# EAGLE design Adafruit SCD-41 (EAGLE 9.6.2)
COMPANY: ADAFRUIT INDUSTRIES; DRAWN: KTOWN; REV: A
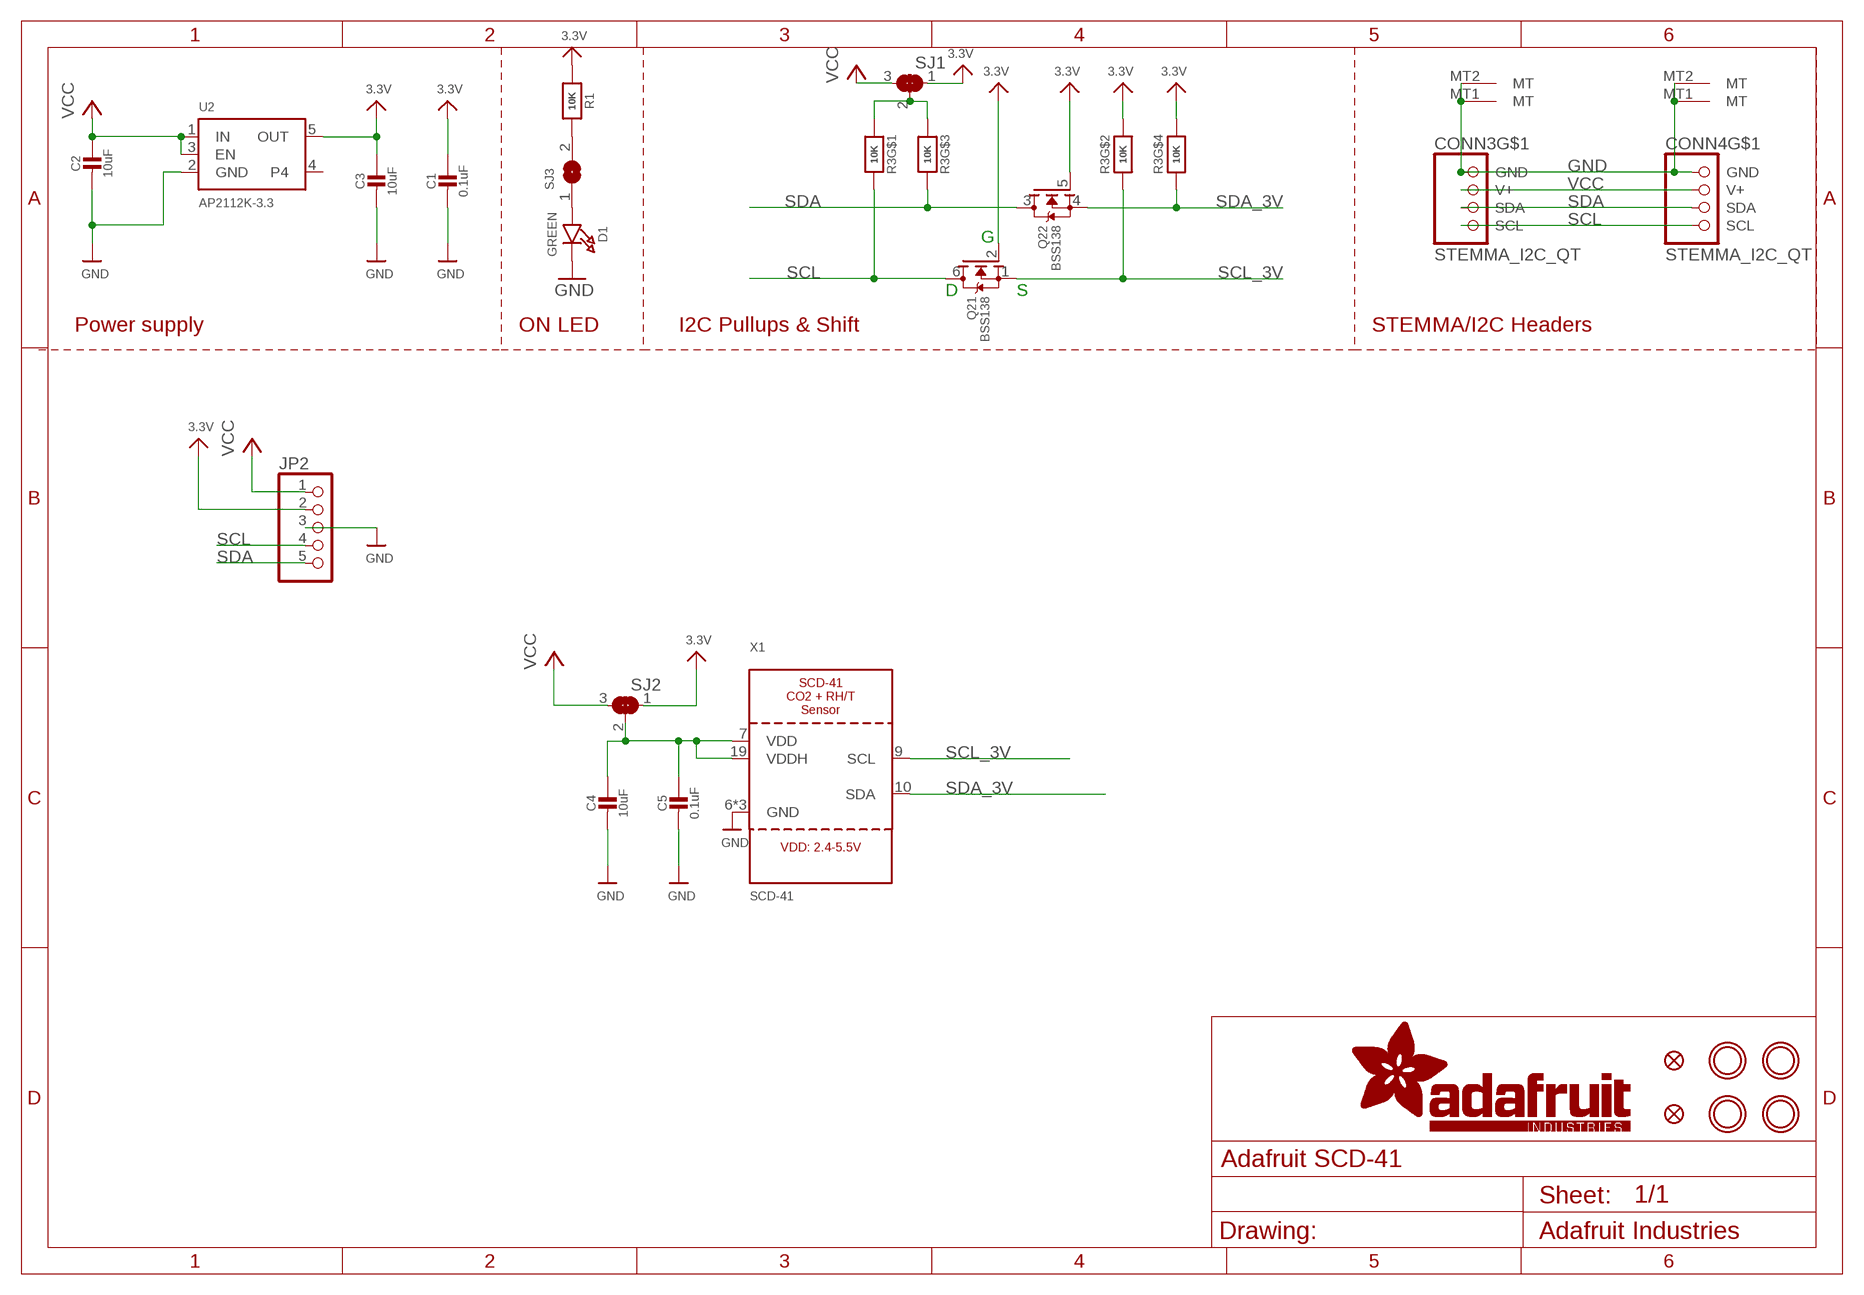
[diagram p0: schematic, sheet 1]

## Parts
C1  0.1uF  CAP_CERAMIC0603_NO  [0603-NO]
C2  10uF  CAP_CERAMIC0805-NOOUTLINE  [0805-NO]
C3  10uF  CAP_CERAMIC0805-NOOUTLINE  [0805-NO]
C4  10uF  CAP_CERAMIC0805-NOOUTLINE  [0805-NO]
C5  0.1uF  CAP_CERAMIC0603_NO  [0603-NO]
CONN3  STEMMA_I2C_QT  [JST_SH4]
CONN4  STEMMA_I2C_QT  [JST_SH4]
D1  GREEN  LED0603_NOOUTLINE  [CHIPLED_0603_NOOUTLINE]
FID3  FIDUCIAL_1MM  [FIDUCIAL_1MM]
FID4  FIDUCIAL_1MM  [FIDUCIAL_1MM]
JP2  HEADER-1X576MIL  [1X05_ROUND_76]
Q2  BSS138  MOSFET-N_DUAL  [SOT363]
R1  10K  RESISTOR_0603_NOOUT  [0603-NO]
R3  10K  RESISTOR_4PACK  [RESPACK_4X0603]
SJ1  SOLDERJUMPER_2WAY  [SOLDERJUMPER_2WAY_OPEN_NOPASTE]
SJ2  SOLDERJUMPER_2WAY  [SOLDERJUMPER_2WAY_OPEN_NOPASTE]
SJ3  SOLDERJUMPERCLOSED  [SOLDERJUMPER_CLOSEDWIRE]
U2  AP2112K-3.3  VREG_SOT23-5  [SOT23-5]
U$1  MOUNTINGHOLE3.0THIN  [MOUNTINGHOLE_3.0_PLATEDTHIN]
U$17  MOUNTINGHOLE3.0THIN  [MOUNTINGHOLE_3.0_PLATEDTHIN]
U$19  MOUNTINGHOLE3.0THIN  [MOUNTINGHOLE_3.0_PLATEDTHIN]
U$21  MOUNTINGHOLE3.0THIN  [MOUNTINGHOLE_3.0_PLATEDTHIN]
X1  SCD-41  [SCD41]

## Nets
3.3V [lowpower]: C1.1 C3.1 JP2.2 Q2.2(1:G) Q2.5(2:G) R1.1 R3.2 R3.4 SJ1.1 SJ2.1 U2.5(OUT)
GND [highpower]: C1.2 C2.2 C3.2 C4.2 C5.2 CONN3.1(GND) CONN3.MT1(MT) CONN3.MT2(MT) CONN4.1(GND) CONN4.MT1(MT) CONN4.MT2(MT) D1.C JP2.3 U2.2(GND) X1.6(GND) X1.20(GND) X1.P$1(GND)
N$1: D1.A SJ3.1
N$2 [highpower]: R3.1 R3.3 SJ1.2
N$3 [lowpower]: C4.1 C5.1 SJ2.2 X1.7(VDD) X1.19(VDDH)
N$4: R1.2 SJ3.2
SCL: CONN3.4(SCL) CONN4.4(SCL) JP2.4 Q2.6(1:D) R3.8
SCL_3V: Q2.1(1:S) R3.7 X1.9(SCL)
SDA: CONN3.3(SDA) CONN4.3(SDA) JP2.5 Q2.3(2:D) R3.6
SDA_3V: Q2.4(2:S) R3.5 X1.10(SDA)
VCC [highpower]: C2.1 CONN3.2(V+) CONN4.2(V+) JP2.1 SJ1.3 SJ2.3 U2.1(IN) U2.3(EN)
Unconnected: U2.4

## Notes on the sheet
- G
- D | S
- Power supply | ON LED | I2C Pullups & Shift | STEMMA/I2C Headers

## Library data of the parts
C1-C5 = microbuilder:CAP_CERAMIC: Ceramic Capacitors For new designs, use the packages preceded by an '_' character since they are more reliable: The following footprints should be used on most boards: _0402 - Standard footprint for regular board layouts _0603 - Standard footprint for regular board layouts _0805 - Standard footprint for regular board layouts _1206 - Standard footprint for regular board layouts For extremely tight-pitch boards where space is at a premium, the following 'micro-pitch' footprints can be used (smaller pads, no silkscreen outline, etc.): _0402MP - Micro-pitch footprint for very dense/compact boards _0603MP - Micro-pitch footprint for very dense/compact boards _0805MP - Micro-pitch footprint for very dense/compact boards _1206MP - Micro-pitch footprint for very dense/compact boards
CONN3 CONN4 = microbuilder:STEMMA_I2C
D1 = microbuilder:LED: LED 0603 - 0603 Surface Mount Package 2mA: Green LED - Low Power (3.9mcd, 2ma, 1.7Vf) - Digikey: 475-2709-2-ND Orange LED - Low Power (9.8mcd, 2ma, 1.8Vf) - Digikey: 475-1194-2-ND Red LED - Low Power (5mcd, 2ma, 1.8Vf) - Digikey: 475-1195-2-ND Yellow LED - Low Power (7mcd, 2ma, 1.8Vf) - Digikey: 475-1196-2-ND 5mA: Blue LED - Low Power (17mcd, 5ma, 2.9Vf) - Digikey: LNJ937W8CRACT-ND 0805 - 0805 Surface Mount Package 2mA: Red LED (8.8mcd, 2mA, 1.8Vf, Clear) - Low Power [Digikey: 475-2510-1-ND] Green LED (5mcd, 2mA, 1.8Vf, Clear) - Low Power [Digikey: 475-2730-1-ND] Yellow LED (11.3mcd, 2mA, 1.8Vf, Clear) - Low Power [Digikey: 475-2555-1-ND] 20mA: Red LED (104mcd, 20mA, Diffused) - LS R976 [Digikey: 475-1278-6-ND] Red LED (12mcd, 20mA, 2.0Vf, Clear) - APT2012EC [Digikey: 754-1128-1-ND] Green LED (15mcd, 20mA, 2.2Vf, Clear) - APT2012GC [Digikey: 754-1131-1-ND] Orange LED (160mcd, 20mA, 2.1Vf, Clear) - APT2012SECK [Digikey: 754-1130-1-ND] 1206 - 1206 Surface Mount Package Green LED (26mcd, 20mA, Diffused) - LG N971 [Digikey: 475-1407-6-ND] Red LED (15mcd, 20mA, Diffused) - LH N974 [Digikey: 475-1416-6-ND] Cree - Cree High-Power Surface Mount LEDs XPEBWT-L1-0000-00D50 - White 111lm 350mA 2.9Vf 6200K 110° XTEAWT-00-0000-00000LEE3 - White 114lm 350mA 2.85Vf 5000K 115° Everlight - Everlight 45-21 Series Surface Mount LEDs 45-21/QK2C-B2832AC2CB2/2T - Warm White 2000mcd 20mA 3.25Vf 3050K 120° 45-21/LK2C-B38452C4CB2/2T - Nuetral White 2000mcd 20mA 3.25Vf 4150K 120° 45-21/LK2C-B50634C6CB2/2T - Cold White 2200mcd 20mA 3.25Vf 5650K 120° PLCC2 Reverse Mount LS T77K-J1L2-1-0-2-R18-Z - Red 11.25mcd 2mA 1.8Vf 630nm 120° LO T77K-L1M2-24-Z - Orange 19.6mcd 2mA 1.8Vf 606nm 120° LY T77K-K2M1-26-Z - Yellow 15.7mcd 2mA 1.8Vf 587nm 120°
FID3 FID4 = microbuilder:FIDUCIAL: Fiducial Alignment Points Various fiducial points for machine vision alignment.; BOM: EXCLUDE
JP2 = microbuilder:HEADER-1X5: PIN HEADER
Q2 = microbuilder:MOSFET-N_DUAL: Dual N-Channel MOSFET SOT363 (2.0x1.25mm) 2N7002PS - 60V, 320mA [Digikey: 568-5984-1-ND]
R1 = microbuilder:RESISTOR: Resistors For new designs, use the packages preceded by an '_' character since they are more reliable: The following footprints should be used on most boards: _0402 - Standard footprint for regular board layouts _0603 - Standard footprint for regular board layouts _0805 - Standard footprint for regular board layouts _1206 - Standard footprint for regular board layouts For extremely tight-pitch boards where space is at a premium, the following 'micro-pitch' footprints can be used (smaller pads, no silkscreen outline, etc.): _0402MP - Micro-pitch footprint for very dense/compact boards _0603MP - Micro-pitch footprint for very dense/compact boards _0805MP - Micro-pitch footprint for very dense/compact boards _1206MP - Micro-pitch footprint for very dense/compact boards
R3 = microbuilder:RESISTOR_4PACK: Resistor Packs (4 resistors) 4 x 0603 10K 1/16W - Digikey: YC164J-10KCT-ND
SJ1 SJ2 = microbuilder:SOLDERJUMPER_2WAY: 2-Way Solder Jumper
SJ3 = microbuilder:SOLDERJUMPER: SMD Solder JUMPER Solder the two pads together to create a connection, or remove the solder to break it. REFLOW - Use this footprint for solder paste and reflow ovens. WAVE - Use this footprint for hand-soldering (larger pads). CLOSED - Has a trace between the two pads to ensure it is closed by default. The trace needs to be cut to disable the jumper, and can be closed again by creating a solder bridge between the two pads.
U2 = adafruit_power:VREG_SOT23-5: SOT23-5 Fixed Voltage Regulators Part Current Out V Out V In V Dropout θJA (°C/W) TJ (°C) Digikey Part No. ADP121 150mA 3.3V 3.4-5.5V 0.09V @ 150mA -- -- ADP121-AUJZ33R7CT-ND ADP121 150mA 3.0V 3.1-5.5V 0.09V @ 150mA -- -- ADP121-AUJZ30R7CT-ND ADP122 300mA 3.3V 3.4-5.5V 0.085V @ 300mA -- -- ADP122AUJZ-3.3-R7CT-ND ADP1712 300mA 3.3V 3.5-5.5V 0.17V @ 300mA -- -- ADP1712AUJZ-3.3-R7TR-ND AP7311 (Low Cost) 150mA 3.3V 3.5-6V 0.15V @ 150mA -- -- AP7311-33WG-7DICT-ND LD39015M18R 150mA 1.8V 1.9V-5.5V 0.08V @ 100mA -- -- 497-6977-1-ND LP2985A-33DBVR 150mA 3.3V 3.3-16V 0.28V @ 150mA 206 150 296-18479-1-ND MCP1824T-3302E/OT 300mA 3.3V 3.5V-6V 0.2V @ 300mA -- -- MCP1824T-3302E/OTCT-ND MIC5205-2.5YM5 TR 150mA 2.5V 2.7-16V 0.165V @ 150mA -- -- 576-1257-2-ND MIC5205-3.0YM5 TR 150mA 3.0V 3.2V-16V 0.165V @ 150mA -- -- 576-1258-2-ND MIC5205-3.3YM5 TR 150mA 3.3V 3.5V-16V 0.165V @ 150mA -- -- 576-1259-2-ND TPS780330220 150mA 3.3V+2.2V 3.6-5.5V 250mV Max -- -- 296-23332-1-ND TDA3663/N1,135 100mA 3.3V 3.5-45V 0.18V @ 50mA -- -- 568-5343-1-ND Max operating temp can be calculated using θJA, TJ (max junction temperature), and power in watts. Set the "Maximum Ambient Temperature" until it reaches TJ ("Max Junction Temperature"), which is the absolute limit for safe use of the regulator: Heat Sink Temperature Calculator <http://www.daycounter.com/Calculators/Heat-Sink-Temperature-Calculator.phtml> For example, With 12V source into a 3.3V LP2985 and a 30mA load, we are dissipating (12V-3.3V) * 0.03A = 0.261W. With a θJA of 206 °C/W, a TJ of 150°C, and 261mW we can safely use the chip without a heat sink up to 75°C (=147.1°C Junction Temperature).
U$1 U$17 U$19 U$21 = adafruit_electromech:MOUNTINGHOLE: Mounting Hole For #2 screws (0.086"/2.18mm width, 0.094"/2.4mm hole) use 2.5mm; BOM: EXCLUDE
X1 = adafruit_sensor:SCD-41

## Net classes
1 highpower: width 0.305 mm, drill 0.483 mm
2 lowpower: width 0.254 mm, drill 0.483 mm

## Board
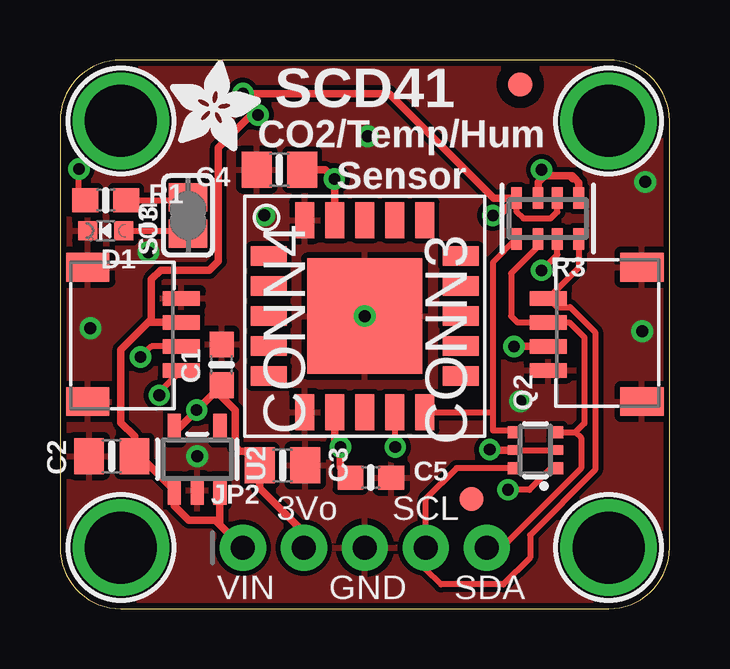
[diagram p1: board, top side]
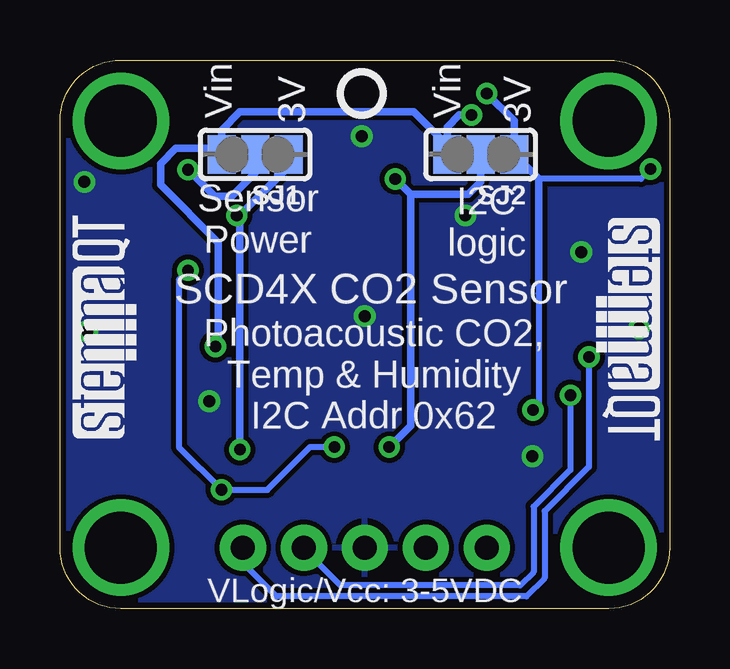
[diagram p2: board, bottom side, seen from below]

Size 25.4 x 22.86 mm. Coordinates in mm from the lower left corner, seen from the top.
Outline: 0,20.32 0,2.54 arc90 2.54,0 22.86,0 arc90 25.4,2.54 25.4,20.32 arc90 22.86,22.86 2.54,22.86 arc90 0,20.32
Copper layers (1*16): Top 0.035mm / dielectric 1.5mm / Bottom 0.035mm
Design rules "adafruit *": minimum track width 8mil, minimum drill 15.5mil, track to track 8mil, track to pad 8mil, pad to pad 8mil, via to via 8mil, smd to smd 8mil, copper to edge 10mil, drill to drill 8mil, minimum pad ring 10mil, minimum via ring 8mil, stop-mask expansion 2mil, vias tented up to drill 20mil, thermal gap 10mil

### Footprints (pad centres in the part's own frame; a part is rotated, then mirrored left to right if it is on the bottom)
0603-NO = smd 1.075 x 1: 1 -0.85,0; 2 0.85,0
0805-NO = smd 1.24 x 1.5: 1 -0.95,0; 2 0.95,0
JST_SH4 = smd 0.6 x 1.55: 1 -1.5,2.514; 2 -0.5,2.514; 3 0.5,2.514; 4 1.5,2.514 | smd 1.2 x 1.8: MT1 -2.8,-1.386; MT2 2.8,-1.386
CHIPLED_0603_NOOUTLINE = smd 0.8 x 0.8: A 0,-0.75; C 0,0.75
FIDUCIAL_1MM = smd 1 x 1: 1 0,0
1X05_ROUND_76 = drill 1 pad 1.93: 1 -5.08,0; 2 -2.54,0; 3 0,0; 4 2.54,0; 5 5.08,0
SOT363 = smd 0.5 x 0.5: 1 -0.75,-0.9; 3 0.75,-0.9; 4 0.75,0.9; 6 -0.75,0.9 | smd 0.4 x 0.5: 2 0,-0.9; 5 0,0.9
RESPACK_4X0603 = smd 0.45 x 0.9: 1 -1.3,-0.85; 2 -0.4,-0.85; 3 0.4,-0.85; 4 1.3,-0.85; 5 1.3,0.85; 6 0.4,0.85; 7 -0.4,0.85; 8 -1.3,0.85
SOLDERJUMPER_2WAY_OPEN_NOPASTE = smd 1.168 x 1.6: 1 -1.397,0; 2 0,0; 3 1.397,0
SOLDERJUMPER_CLOSEDWIRE = smd 1.168 x 1.6: 1 -0.762,0; 2 0.762,0 | smd 0.635 x 0.203: WIRE 0,0
SOT23-5 = smd 0.55 x 1.2: 1 -0.95,-1.3; 2 0,-1.3; 3 0.95,-1.3; 4 0.95,1.3; 5 -0.95,1.3
MOUNTINGHOLE_3.0_PLATEDTHIN = drill 3 pad 3.6: P$1 0,0
SCD41 = smd 1.5 x 0.8: 1 -4,2.5; 2 -4,1.25; 3 -4,0; 4 -4,-1.25; 5 -4,-2.5; 11 4,-2.5; 12 4,-1.25; 13 4,0; 14 4,1.25; 15 4,2.5 | smd 0.8 x 1.5: 6 -2.5,-4; 7 -1.25,-4; 8 0,-4; 9 1.25,-4; 10 2.5,-4; 16 2.5,4; 17 1.25,4; 18 0,4; 19 -1.25,4; 20 -2.5,4 | smd 4.8 x 4.8: P$1 0,0

### Placement (x,y rotation side)
C1  6.73,10.16 90 top
C2  2.16,6.35 180 top
C3  9.27,5.97 0 top
C4  9.14,18.29 180 top
C5  12.95,5.46 0 top
CONN3  22.86,11.43 90 top
CONN4  2.54,11.43 270 top
D1  1.91,15.75 90 top
FID3  19.18,21.84 0 top
FID4  17.14,4.57 0 top
JP2  12.7,2.54 0 top
Q2  19.81,6.6 90 top
R1  1.91,17.02 0 top
R3  20.32,16.26 180 top
SJ1  17.27,18.92 180 bottom
SJ2  7.87,18.92 180 bottom
SJ3  5.33,16.38 90 top
U2  5.71,6.22 0 top
U$1  2.54,20.32 0 top
U$17  22.86,20.32 0 top
U$19  2.54,2.54 0 top
U$21  22.86,2.54 0 top
U$22  [ADAFRUIT_3.5MM]  4.57,19.05 0 top
U$25  [PCBFEAT-REV-040]  12.83,21.46 0 bottom
U$30  [STEMMAQT]  22.23,7.11 90 bottom
U$31  [STEMMAQT]  3.05,16.26 270 bottom
X1  12.7,12.19 0 top

### Tracks (layer width: path | path; a pad name or v marks a point on that pad's centre or on a via)
3.3V  (via drill 0.48)
  Top 0.254: R3.4 19.02,16.54 19.3,16.26 20.45,16.26 20.72,16.53 R3.2 | 9.75,2.54 JP2.2 10.73,3.11 | Q2.5 Q2.2 | R1.1 0.79,17.28 v0.79,18.32
  Top 0.305: JP2.2 10.16,3.17 8.32,5.01 C3.1 7.72,6.57 7.49,6.57 7.3,6.76 7.3,8.27 6.73,8.84 C1.1 v5.7,8.27 4.94,7.52 U2.5 | v18.03,16.38 18.3,16.38 R3.4 18.07,17.11 13.72,21.46 v7.62,21.46 | v17.91,6.63 17.93,6.6 Q2.5
  Bottom 0.254: v5.7,8.27 5.46,8.51 5.46,13.13 5.46,13.64 | v0.79,18.32 1.2,17.91 5.46,17.91
  Bottom 0.305: v18.03,16.38 18.03,16.26 17.91,16.38 | 17.91,16.38 v17.91,6.63 | 5.46,13.64 5.46,17.91 SJ2.1 6.48,20.32 v7.62,21.46 | 15.88,18.41 17.91,16.38 | SJ1.1 16.33,18.47 16.33,17.98 17.91,16.4 17.91,16.38
GND  (via drill 0.5)
  other vias: 1.27,11.68 12.7,12.19 8.51,16.38 19.18,8.64 24.26,11.56 5.71,6.35 3.68,14.86 12.83,19.68 24.38,17.78
  pour Top: 0,22.86 25.4,22.86 25.4,0 0,0
  pour Bottom: 0,22.86 25.4,22.86 25.4,0 0,0
N$1
  Top 0.254: D1.A 5.21,15.75 SJ3.1
N$2  (via drill 0.48)
  Top 0.305: R3.3 19.92,17.76 20.19,18.03 20.32,18.03 | 21.34,18.03 21.46,17.91 | 21.46,17.91 21.62,17.75 R3.1 | v20.07,18.29 20.32,18.03 | 20.32,18.03 21.24,18.03 21.37,17.91 21.46,17.91
  Bottom 0.305: SJ1.2 17.27,18.16 18.25,17.18 18.96,17.18 v20.07,18.29
N$3  (via drill 0.48)
  Top 0.305: X1.7 11.45,6.96 v11.68,6.73 11.68,5.88 C5.1 | X1.19 11.45,17.89 v11.43,17.91 11.05,18.29 C4.1
  Bottom 0.305: v11.68,6.73 10.79,7.62 10.79,17.27 | 10.79,17.27 v11.43,17.91 | SJ2.2 7.87,17.78 8.38,17.27 10.79,17.27
N$4
  Top 0.254: R1.2 5.21,17.02 SJ3.2
N$5
  Bottom 0.305: 16.76,18.92 16.38,18.92
N$6
  Bottom 0.305: 8.38,18.92 8.76,18.92
SCL  (via drill 0.48)
  Top 0.254: CONN4.4 4.13,9.01 v4.13,8.89 | Q2.6 16.52,5.85 15.24,4.57 JP2.4 15.24,1.65 15.88,1.02 18.47,1.02 19.58,2.13 19.58,3.06 22.3,5.78 22.3,11.52 21.26,12.56 20.72,12.56 CONN3.4 21.62,14.2 R3.8
  Bottom 0.254: v4.13,8.89 4.13,5.78 5.66,4.25 5.66,1.52 6.22,0.96 13.72,0.96 15.24,2.49 JP2.4
SCL_3V  (via drill 0.48)
  Top 0.254: X1.9 13.95,6.75 v13.97,6.73 | Q2.1 20.46,5.85 19.56,4.95 v18.67,4.95 | v20.07,14.1 20.72,14.75 R3.7
  Bottom 0.254: v13.97,6.73 14.99,6.73 16.76,4.95 v18.67,4.95 20.45,6.73 20.45,13.72 v20.07,14.1
SDA  (via drill 0.48)
  Top 0.254: CONN4.3 3.81,10.93 v3.36,10.48 | Q2.3 21.48,7.35 | 21.48,7.35 21.72,7.11 21.72,5.84 18.41,2.54 JP2.5 | 21.48,7.35 21.84,7.72 21.84,11.3 21.22,11.93 CONN3.3 19.06,11.93 18.8,12.19 18.8,13.97 19.92,15.09 R3.6
  Bottom 0.254: v3.36,10.48 3.36,5.91 5.21,4.06 5.21,1.27 5.97,0.51 16.38,0.51 17.78,1.91 JP2.5
SDA_3V
  Top 0.254: 15.37,8.19 18.03,8.19 | Q2.4 18.84,7.43 18.03,7.43 18.03,8.19 | R3.5 18.03,14.42 18.03,8.19
  Top 0.305: X1.10 15.37,8.19 | X1.10
VCC  (via drill 0.48)
  Top 0.305: 3.67,11.93 CONN4.2 | 3.67,11.93 2.54,10.79 2.54,7.75 3.11,7.18 C2.1 3.34,6.35 U2.1 4.76,4.29 5.38,3.68 6.48,3.68 JP2.1 6.67,3.5 U2.3 | 3.67,11.93 3.81,12.06 3.81,13.72 4.19,14.1 6.22,14.1 6.6,14.48 6.6,19.21 7.97,20.57 v8.26,20.57 | CONN3.2 18.93,10.93 v18.92,10.92
  Bottom 0.305: SJ2.3 9.27,19.3 | 9.27,19.3 10.67,20.7 17.91,20.7 18.67,19.94 SJ1.3 18.92,19.18 20.57,19.18 21.21,18.54 21.21,17.65 18.8,15.24 18.8,11.05 v18.92,10.92 | v8.26,20.57 8.76,20.57 9.27,20.07 9.27,19.3

### Text on the board
tPlace: SCD41 | CO2/Temp/Hum / Sensor | on | 3Vo | SCL | VIN | GND | SDA
bPlace: Vin | Vin | 3V | 3V | I2C / logic | Sensor / Power | SCD4X CO2 Sensor | Photoacoustic CO2, / Temp & Humidity / I2C Addr 0x62 | VLogic/Vcc: 3-5VDC